# Altium schematic sheet 3_shkb_lite_mini_bt_kbd.SchDoc: =ProjectTitle
size A4; Address1: github.com/4pplet/cyber60; Address2: Licence: CERN-OHL-S; SheetNumber: 3; SheetTotal: 5
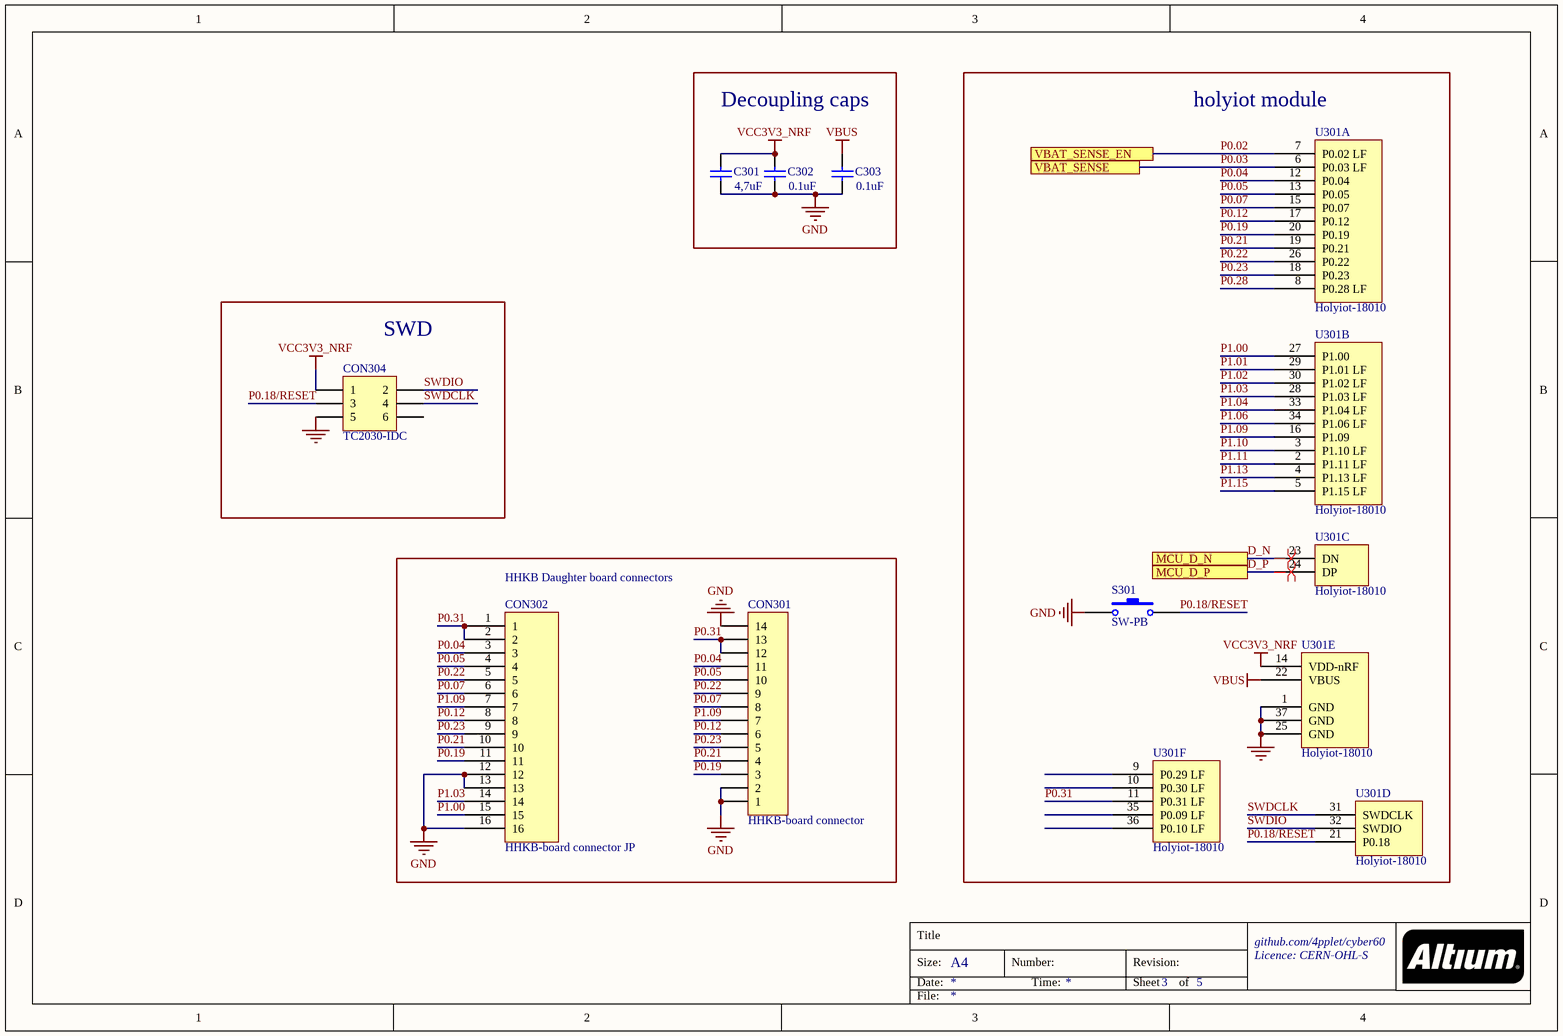
[diagram p0: 3_shkb_lite_mini_bt_kbd.SchDoc]

## Parts
C301  value 4,7uF  [C0603[1608]]
C302  value 0.1uF  [C0603[1608]]
C303  value 0.1uF  [C0603[1608]]
CON301  HHKB-board connector  [JST S13B-ZR-SM4A-TF(LF)(SN)]
CON302  HHKB-board connector JP  [DF14A-15P-1.25H]  (no BOM)
CON304  TC2030-IDC  [TC2030-IDC-NL]  (no BOM)
S301  SW-PB  [Wurth 431256038736]
U301  Holyiot-18010  [Holyiot-18010 - outer pads]  (parts A,B,C,D,E,F of 6)

## Blocks framed on the sheet
Decoupling caps: C301-C303
holyiot module: S301 U301
SWD: CON304
HHKB Daughter board connectors: CON301 CON302

## Ports
MCU_D_N, MCU_D_P, VBAT_SENSE, VBAT_SENSE_EN

## Nets
GND: C301.1 C302.1 C303.1 CON301.1 CON301.2 CON301.14 CON302.12 CON302.13 CON302.16 CON304.5 S301.2 S301.3(GND) U301.1(GND) U301.25(GND) U301.37(GND)
VBUS: C303.2 U301.22(VBUS)
VCC3V3_NRF: C301.2 C302.2 CON304.1 U301.14(VDD-nRF)
D_N: U301.23(DN) ; port MCU_D_N
D_P: U301.24(DP) ; port MCU_D_P
P0.02: U301.7(P0.02_LF) ; port VBAT_SENSE_EN
P0.03: U301.6(P0.03_LF) ; port VBAT_SENSE
P0.04: CON301.11 CON302.3 U301.12(P0.04)
P0.05: CON301.10 CON302.4 U301.13(P0.05)
P0.07: CON301.8 CON302.6 U301.15(P0.07)
P0.12: CON301.6 CON302.8 U301.17(P0.12)
P0.18/RESET: CON304.3 S301.1 U301.21(P0.18)
P0.19: CON301.3 CON302.11 U301.20(P0.19)
P0.21: CON301.4 CON302.10 U301.19(P0.21)
P0.22: CON301.9 CON302.5 U301.26(P0.22)
P0.23: CON301.5 CON302.9 U301.18(P0.23)
P0.28: U301.8(P0.28_LF)
P0.31: CON301.12 CON301.13 CON302.1 CON302.2 U301.11(P0.31_LF)
P1.00: CON302.15 U301.27(P1.00)
P1.01: U301.29(P1.01_LF)
P1.02: U301.30(P1.02_LF)
P1.03: CON302.14 U301.28(P1.03_LF)
P1.04: U301.33(P1.04_LF)
P1.06: U301.34(P1.06_LF)
P1.09: CON301.7 CON302.7 U301.16(P1.09)
P1.10: U301.3(P1.10_LF)
P1.11: U301.2(P1.11_LF)
P1.13: U301.4(P1.13_LF)
P1.15: U301.5(P1.15_LF)
SWDCLK: CON304.4 U301.31(SWDCLK)
SWDIO: CON304.2 U301.32(SWDIO)

Not connected (* = marked no-connect by the designer): CON304 6; U301 9(P0.29_LF) 10(P0.30_LF) 35(P0.09_LF) 36(P0.10_LF)

## Layout directives
differential pair: D_N, D_P

## Notes on the sheet
- Title
- Size:
- Date:
- A4
- Number:
- Time:
- Revision:
- Sheet
- of
- File:

## Library data of the parts
C301 = Cap: Capacitor; MRF.Part: CL10A475KO8NNNC; LCSC MFG: Samsung Electro-Mechanics; LCSC Part #: C19666
C302 C303 = Cap: Capacitor; MRF.Part: CC0603KRX7R9BB104; MFG: KEMET; MFGPN: C0603C104M5RACTU; LCSC MFG: YAGEO; Version: 0603 imperial; LCSC Part #: C14663
CON301 = Header 14: MFGPN: S13B-ZR-SM4A-TF(LF)(SN); MFG: JST Sales America Inc; LCSC MFG: JST Sales America; LCSC Part #: C265326; MRF.Part: S13B-ZR-SM4A-TF(LF)(SN)
CON302 = DF14A-15P-1.25H: MFG: Hirose Electric Co Ltd; MFGPN: DF14A-15P-1.25H(26); LCSC MFG: HRS(Hirose); LCSC Part #: C597889; MRF.Part: DF14A-15P-1.25H(26)
CON304 = Header 3X2: Header, 3-Pin, Dual row
S301 = SW-PB: Switch; MRF.Part: K2-1102AQ-C4CW-01; MFGPN: 431256038736; MFG: Wurth Electronics Inc; LCSC MFG: Korean Hroparts Elec; LCSC Part #: C127680
U301 = Holyiot-18010: MFGPN: YJ-18010; MFG: Holyiot